# EAGLE design smart-home.matherboard (EAGLE 9.6.2)
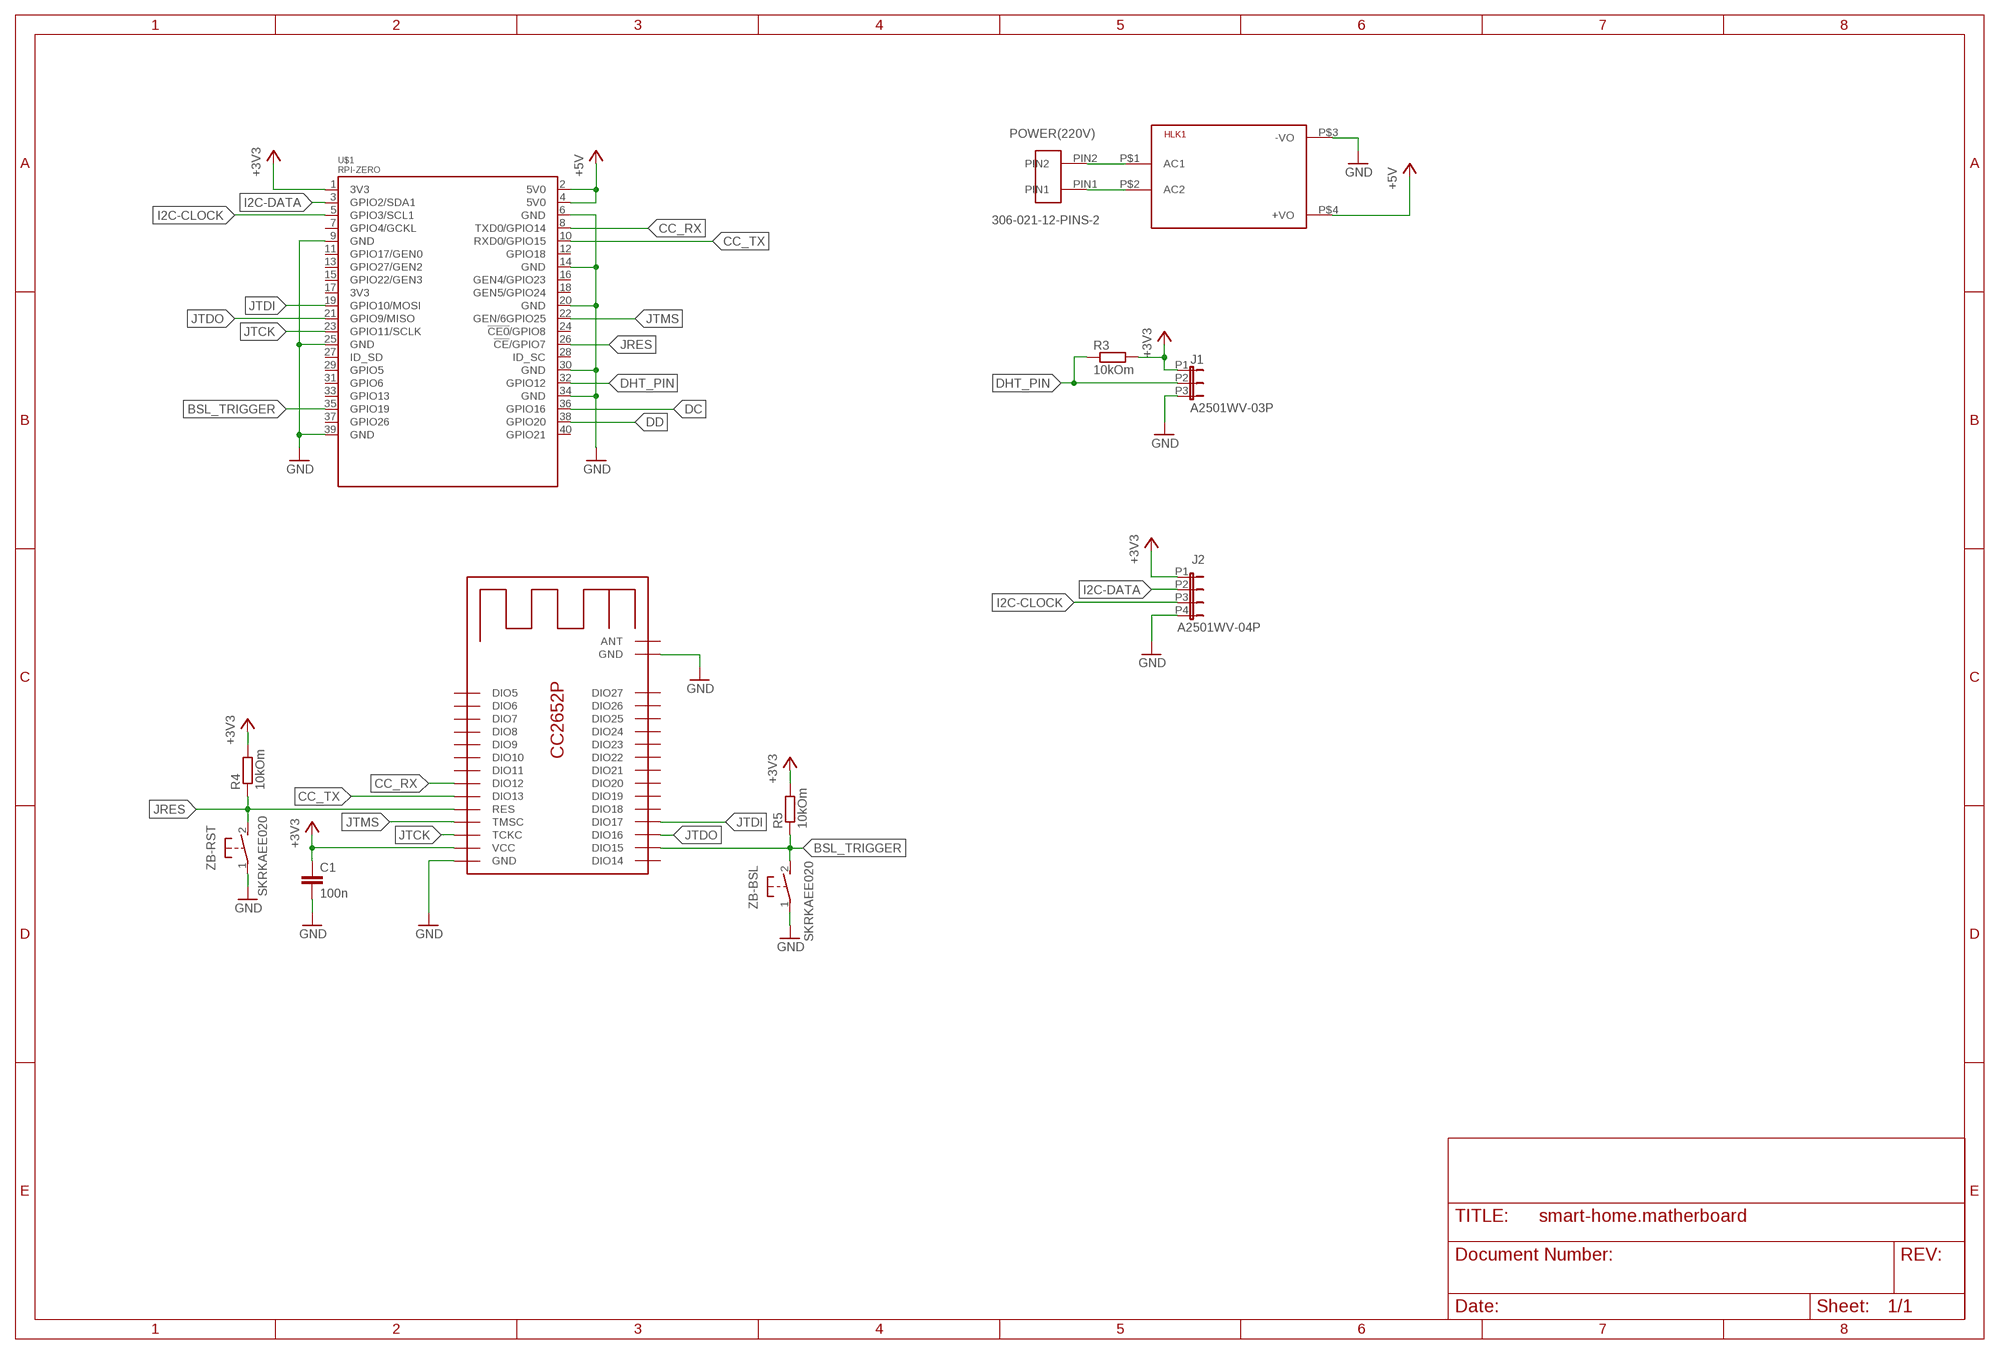
[diagram p0: schematic, sheet 1]

## Parts
C1  100n  C-EUC0603K  [C0603K]
HLK1  HLK-PM013W  [HLK-PM01]
J1  A2501WV-03P  [A2501WV-03P]
J2  A2501WV-04P  [A2501WV-04P]
POWER(220V)  306-021-12-PINS-2  [SERIA-306-2PIN]
R3  10kOm  R-EU_R0603  [R0603]
R4  10kOm  R-EU_R0603  [R0603]
R5  10kOm  R-EU_R0603  [R0603]
U1  CC2652P2-DUOWEISI  [CC2653P2-DUOWEISI]
U$1  RPI-ZERO  [RASPBERRYPI_BASTELSTUBE_V13_RASPI_BOARD_B+_FULL]
ZB-BSL  SKRKAEE020  [SKRKAEE020]
ZB-RST  SKRKAEE020  [SKRKAEE020]

## Nets
+3V3: C1.1 J1.P1 J2.P1 R3.2 R4.2 R5.2 U1.VCC U$1.1(3V3)
+5V: HLK1.P$4(+VO) U$1.2(5V0) U$1.4(5V0)
BSL_TRIGGER: R5.1 U1.DIO15 U$1.35(GPIO19) ZB-BSL.2
CC_RX: U1.DIO12 U$1.8(TXD0/GPIO14)
CC_TX: U1.DIO13 U$1.10(RXD0/GPIO15)
DC: U$1.36(GPIO16)
DD: U$1.38(GPIO20)
DHT_PIN: J1.P2 R3.1 U$1.32(GPIO12)
GND: C1.2 HLK1.P$3(-VO) J1.P3 J2.P4 U1.GND U1.GND@1(GND) U$1.6(GND) U$1.9(GND) U$1.14(GND) U$1.20(GND) U$1.25(GND) U$1.30(GND) U$1.34(GND) U$1.39(GND) ZB-BSL.1 ZB-RST.1
I2C-CLOCK: J2.P3 U$1.5(GPIO3/SCL1)
I2C-DATA: J2.P2 U$1.3(GPIO2/SDA1)
JRES: R4.1 U1.RES U$1.26(!CE!/GPIO7) ZB-RST.2
JTCK: U1.TCKC U$1.23(GPIO11/SCLK)
JTDI: U1.DIO17 U$1.19(GPIO10/MOSI)
JTDO: U1.DIO16 U$1.21(GPIO9/MISO)
JTMS: U1.TMSC U$1.22(GEN/6GPIO25)
N$1: HLK1.P$1(AC1) POWER(220V).PIN2
N$2: HLK1.P$2(AC2) POWER(220V).PIN1
Unconnected: U1.ANT U1.DIO5 U1.DIO6 U1.DIO7 U1.DIO8 U1.DIO9 U1.DIO10 U1.DIO11 U1.DIO14 U1.DIO18 U1.DIO19 U1.DIO20 U1.DIO21 U1.DIO22 U1.DIO23 U1.DIO24 U1.DIO25 U1.DIO26 U1.DIO27 U$1.7(GPIO4/GCKL) U$1.11(GPIO17/GEN0) U$1.12(GPIO18) U$1.13(GPIO27/GEN2) U$1.15(GPIO22/GEN3) U$1.16(GEN4/GPIO23) U$1.17(3V3) U$1.18(GEN5/GPIO24) U$1.24(!CE0!/GPIO8) U$1.27(ID_SD) U$1.28(ID_SC) U$1.29(GPIO5) U$1.31(GPIO6) U$1.33(GPIO13) U$1.37(GPIO26) U$1.40(GPIO21)

## Library data of the parts
C1 = rcl:C-EU: CAPACITOR, European symbol; SPICEPREFIX: C
HLK1 = HLK-PM01:HLK-PM01: Hi-Link Power Supply HLK-PM01 3W Author: Ahmed Said <https://github.com/AhmedSaid/EAGLELibraries>
J1 = jt:A2501WV-03P
J2 = jt:A2501WV-04P
POWER(220V) = Конекторы:306-021-12
R3-R5 = rcl:R-EU_: RESISTOR, European symbol; SPICEPREFIX: R
U1 = codm:CC2652P2-DUOWEISI
U$1 = RPI-Zero:RPI-ZERO
ZB-BSL ZB-RST = switch:SKRKAEE020: Manufacturered by Alps Alpine Tactile Switches SKRKAEE020

## Board
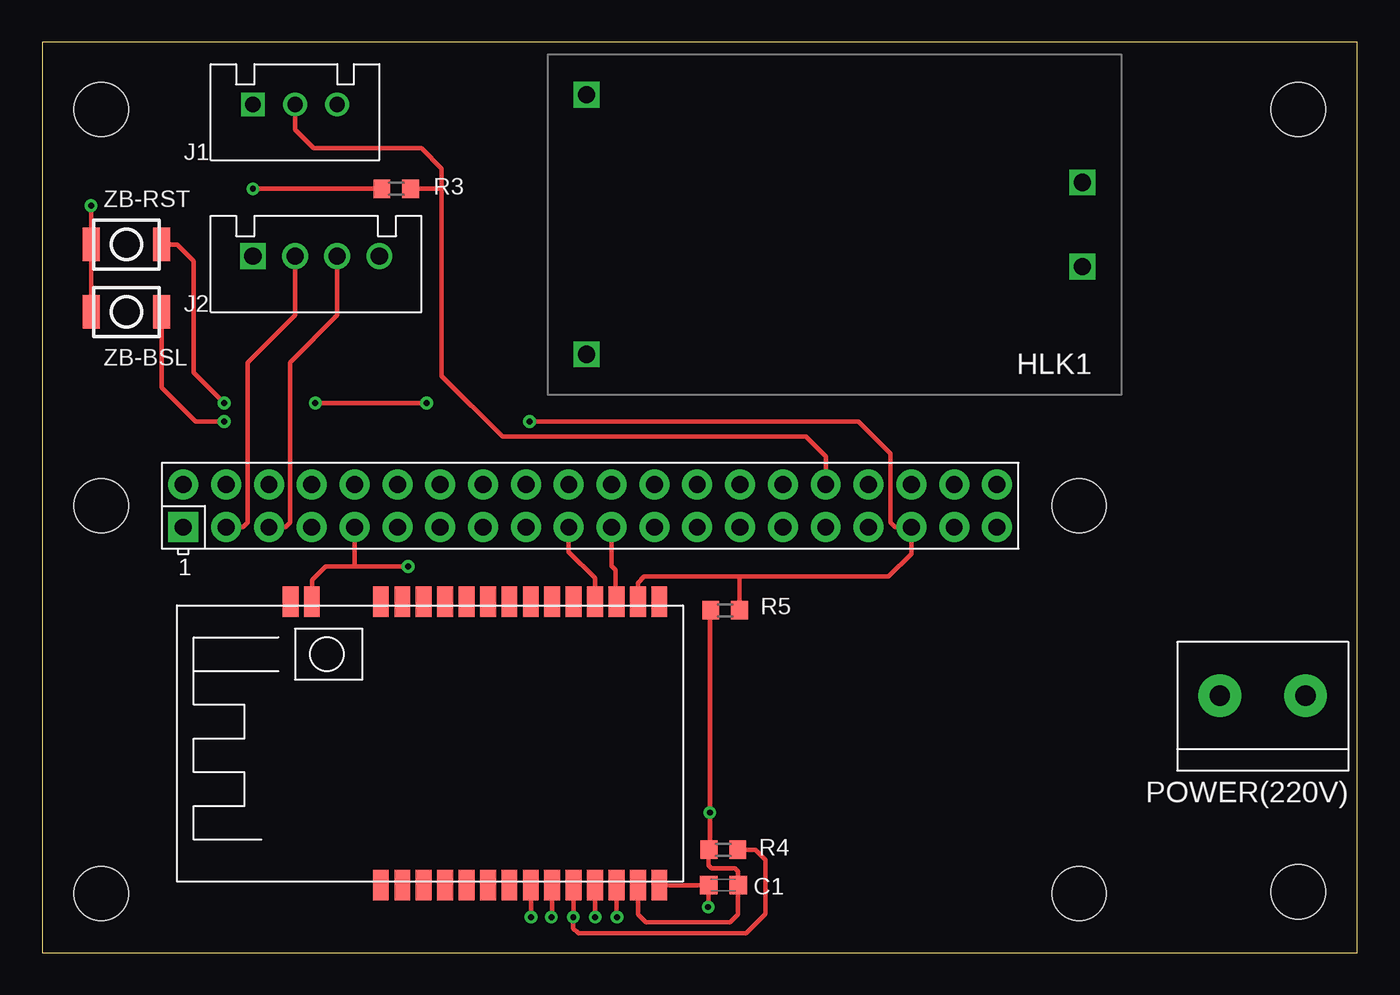
[diagram p1: board, top side]
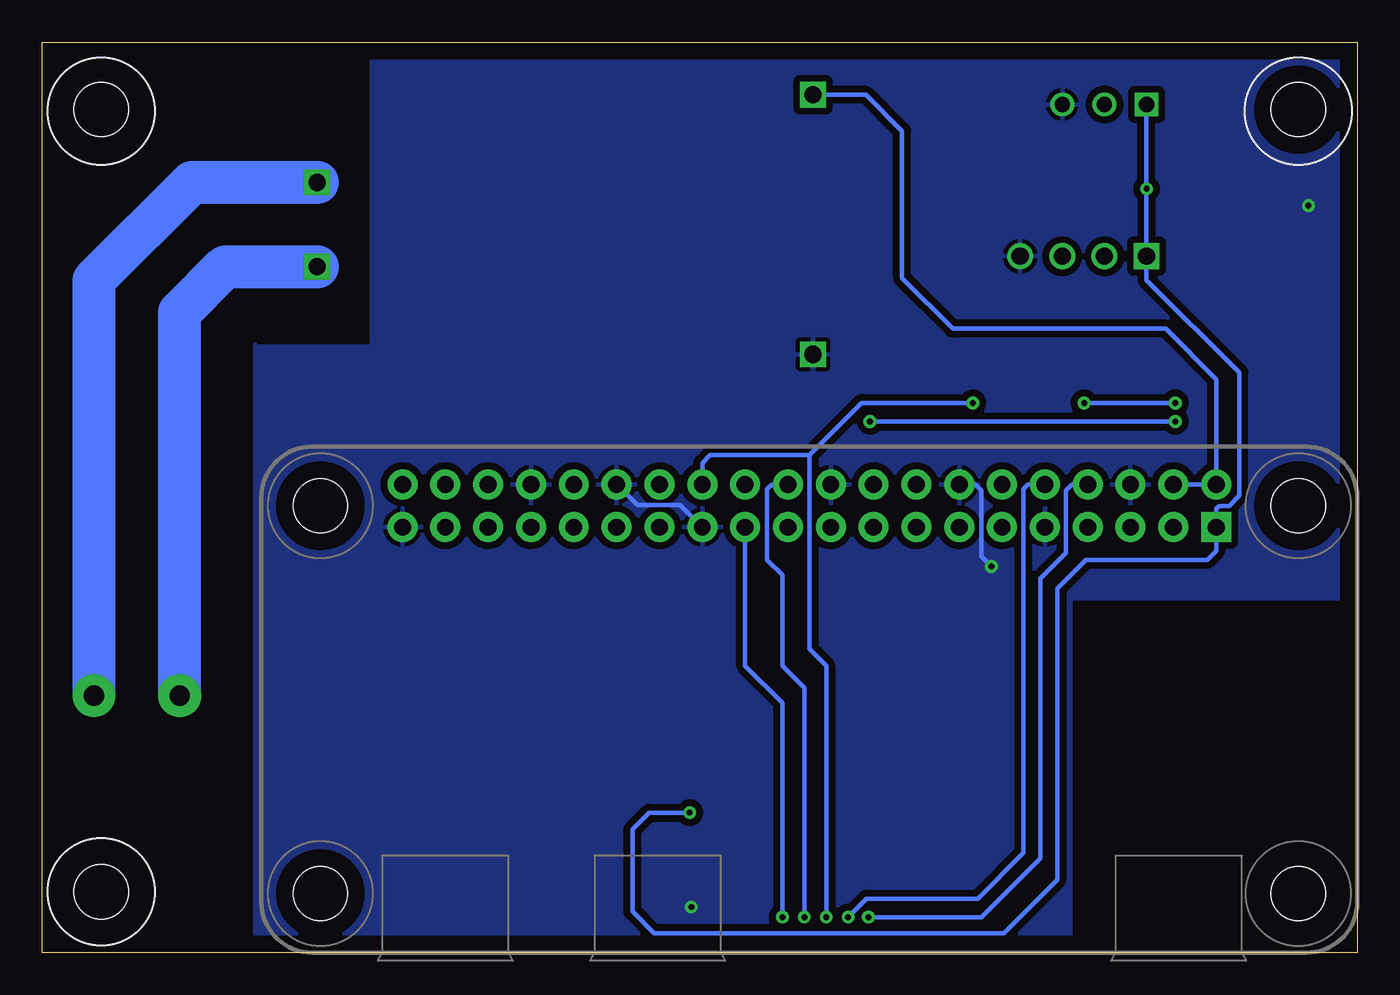
[diagram p2: board, bottom side, seen from below]

Size 78 x 54 mm. Coordinates in mm from the lower left corner, seen from the top.
Outline: 0,0 78,0 78,54 0,54 0,0
Copper layers (1*16): Top 0.035mm / dielectric 1.5mm / Bottom 0.035mm
Design rules "default": minimum track width 6mil, minimum drill 0.35mm, track to track 6mil, track to pad 6mil, pad to pad 6mil, via to via 6mil, smd to smd 6mil, copper to edge 40mil, drill to drill 6mil, minimum pad ring 10mil, minimum via ring 8mil, stop-mask expansion 4mil, vias tented up to drill 0mil, thermal gap 10mil
Holes 3.2 mm at 3.5,50 74.5,50 74.5,3.6 3.5,3.5 3.5,26.5 61.5,3.5 61.5,26.5

### Footprints (pad centres in the part's own frame; a part is rotated, then mirrored left to right if it is on the bottom)
C0603K = smd 1.05 x 1.08: 1 -0.875,0; 2 0.875,0
HLK-PM01 = drill 1.016 square: P$1 -14.7,2.5; P$2 -14.7,-2.5; P$3 14.7,7.7; P$4 14.7,-7.7
A2501WV-03P = drill 0.9 square: P1 2.5,3.3 | drill 0.9: P2 5,3.3; P3 7.5,3.3
A2501WV-04P = drill 1.02 square: P1 2.5,3.3 | drill 1.02: P2 5,3.3; P3 7.5,3.3; P4 10,3.3
SERIA-306-2PIN = drill 1.2 pad 2.54: PIN1 -2.54,0; PIN2 2.54,0
R0603 = smd 1 x 1.1: 1 -0.85,0; 2 0.85,0
CC2653P2-DUOWEISI = smd 1.8 x 0.94: ANT 16.6,23.27; DIO5 -0.2,17.91; DIO6 -0.2,16.64; DIO7 -0.2,15.37; DIO8 -0.2,14.1; DIO9 -0.2,12.83; DIO10 -0.2,11.56; DIO11 -0.2,10.29; DIO12 -0.2,9.02; DIO13 -0.2,7.75; DIO14 16.6,1.4; DIO15 16.6,2.67; DIO16 16.6,3.94; DIO17 16.6,5.21; DIO18 16.6,6.48; DIO19 16.6,7.75; DIO20 16.6,9.02; DIO21 16.6,10.29; DIO22 16.6,11.56; DIO23 16.6,12.83; DIO24 16.6,14.1; DIO25 16.6,15.37; DIO26 16.6,16.64; DIO27 16.6,17.91; GND -0.2,1.4; GND@1 16.6,22; RES -0.2,6.48; TCKC -0.2,3.94; TMSC -0.2,5.21; VCC -0.2,2.67
RASPBERRYPI_BASTELSTUBE_V13_RASPI_BOARD_B+_FULL = drill 1 pad 1.778 square: 1 8.37,25.23 | drill 1 pad 1.778: 2 8.37,27.77; 3 10.91,25.23; 4 10.91,27.77; 5 13.45,25.23; 6 13.45,27.77; 7 15.99,25.23; 8 15.99,27.77; 9 18.53,25.23; 10 18.53,27.77; 11 21.07,25.23; 12 21.07,27.77; 13 23.61,25.23; 14 23.61,27.77; 15 26.15,25.23; 16 26.15,27.77; 17 28.69,25.23; 18 28.69,27.77; 19 31.23,25.23; 20 31.23,27.77; 21 33.77,25.23; 22 33.77,27.77; 23 36.31,25.23; 24 36.31,27.77; 25 38.85,25.23; 26 38.85,27.77; 27 41.39,25.23; 28 41.39,27.77; 29 43.93,25.23; 30 43.93,27.77; 31 46.47,25.23; 32 46.47,27.77; 33 49.01,25.23; 34 49.01,27.77; 35 51.55,25.23; 36 51.55,27.77; 37 54.09,25.23; 38 54.09,27.77; 39 56.63,25.23; 40 56.63,27.77
SKRKAEE020 = smd 1 x 2: 1 -2.1,0; 2 2.1,0

### Placement (x,y rotation side)
C1  40.4,4 180 top
DRILEGEND  [DRILEGEND]  -14.13,-18.14 0 top  (outside the outline)
HLK1  46.99,43.18 180 top
J1  10,47 0 top
J2  10,38 0 top
POWER(220V)  72.39,15.24 180 top
R3  21,45.3 180 top
R4  40.4,6.1 180 top
R5  40.5,20.3 180 top
U1  38,4.2 90 top
U$1  0,0 0 top
ZB-BSL  5,38 0 top
ZB-RST  5,42 0 top

### Tracks (layer width: path | path; a pad name or v marks a point on that pad's centre or on a via)
+3V3  (via drill 0.35)
  Top 0.254: U1.VCC 35.33,2.27 35.8,1.8 40.8,1.8 41.27,2.27 C1.1 41.27,4.83 41.1,5 39.7,5 39.52,5.17 39.52,6.08 R4.2 39.6,6.15 v39.6,8.3 39.6,20.25 R5.2 | R3.2 v12.5,45.3
  Bottom 0.254: v39.6,8.3 42,8.3 43,7.3 43,2.44 41.7,1.14 20.96,1.14 17.8,4.3 17.8,21.6 16.1,23.3 8.9,23.3 8.37,23.83 U$1.1 8.37,26.33 8.2,26.5 7.6,26.5 7,27.1 7,34.4 12.5,39.9 J2.P1 v12.5,45.3 J1.P1
+5V
  Bottom 0.254: U$1.4 U$1.2 8.37,34 11.37,37 24,37 27,40 27,48.73 29.15,50.88 HLK1.P$4
BSL_TRIGGER  (via drill 0.35)
  Top 0.254: U1.DIO15 35.33,21.93 35.7,22.3 41.4,22.3 | 41.4,22.3 50.2,22.3 51.55,23.65 U$1.35 50.57,25.23 50.3,25.5 50.3,29.6 48.4,31.5 30,31.5 v28.9,31.5 | R5.1 41.35,22.25 41.4,22.3 | v10.8,31.5 9.1,31.5 7.1,33.5 ZB-BSL.2
  Bottom 0.254: v28.9,31.5 v10.8,31.5
CC_RX  (via drill 0.35)
  Top 0.254: U1.DIO12 29,3.98 v29,2.1
  Bottom 0.254: v29,2.1 22.3,2.1 18.8,5.6 18.8,22.2 17.3,23.7 17.3,27.4 16.93,27.77 U$1.8
CC_TX  (via drill 0.35)
  Top 0.254: U1.DIO13 30.25,2.15 v30.2,2.1
  Bottom 0.254: v30.2,2.1 29.1,3.2 22.5,3.2 19.8,5.9 19.8,27.5 19.53,27.77 U$1.10
DHT_PIN
  Top 0.254: U$1.32 46.47,29.43 45.3,30.6 27.3,30.6 23.7,34.2 23.7,45.3 | 23.7,45.3 23.7,46.5 22.5,47.7 16.1,47.7 15,48.8 J1.P2 | R3.1 23.7,45.3
GND  (via drill 0.35)
  Top 0.254: U1.GND C1.2 39.52,2.73 v39.5,2.7 | U1.GND@1 16,22.1 16.8,22.9 18.5,22.9 | 18.5,22.9 v21.7,22.9 | U$1.9 18.53,22.93 18.5,22.9 | v2.9,44.3 ZB-RST.1 ZB-BSL.1
  Bottom 0.254: U$1.25 40.16,26.54 42.7,26.54 U$1.30 | U$1.14 23.62,27.78 22.68,27.78 22.3,27.4 22.3,23.5 v21.7,22.9
  pour Bottom (isolate 0.406): 17,0 65.37,0 65.37,36.06 65.24,35.94 58.55,35.94 58.42,36.07 58.42,53.85 17.03,53.85 0,54 0,21 17,21 17.03,20.97 17.03,0.03
I2C-CLOCK
  Top 0.254: J2.P3 17.5,37.8 14.7,35 14.7,25.5 14.43,25.23 U$1.5
I2C-DATA
  Top 0.254: U$1.3 11.93,25.23 12.2,25.5 12.2,35 15,37.8 J2.P2
JRES  (via drill 0.35)
  Top 0.254: U1.RES 31.52,2.12 v31.5,2.1 31.5,1.44 31.8,1.14 41.74,1.14 42.9,2.3 42.9,5.5 42.3,6.1 R4.1 | v10.8,32.6 9,34.4 9,41 8,42 ZB-RST.2 | v22.8,32.6 v16.2,32.6
  Bottom 0.254: v31.5,2.1 31.5,17 32.5,18 32.5,29.5 | 32.5,29.5 38.4,29.5 38.85,29.05 U$1.26 | v16.2,32.6 v10.8,32.6 | 32.5,29.5 29.4,32.6 v22.8,32.6
JTCK  (via drill 0.35)
  Top 0.254: U1.TCKC 34.06,2.14 v34.1,2.1
  Bottom 0.254: v34.1,2.1 34.1,14.8 36.31,17.01 U$1.23
JTDI
  Top 0.254: U$1.19 31.23,23.77 32.79,22.21 U1.DIO17
JTDO
  Top 0.254: U1.DIO16 34,20.86 34,22.7 33.77,22.93 U$1.21
JTMS  (via drill 0.35)
  Top 0.254: U1.TMSC v32.79,2.11 v32.8,2.1
  Bottom 0.254: v32.8,2.1 32.8,15.7 34.1,17 34.1,22.4 35,23.3 35,27.5 34.73,27.77 U$1.22
N$1
  Bottom 2.54: POWER(220V).PIN2 69.85,37.97 67.14,40.68 HLK1.P$1
N$2
  Bottom 2.54: HLK1.P$2 69.13,45.68 74.93,39.88 POWER(220V).PIN1

### Text on the board
tDocu: DHT22 | I2C
DrillLegend: LAYER-STACK
DrillLegend_01-16: 01-16
DrillLegend_01-20: 01-20